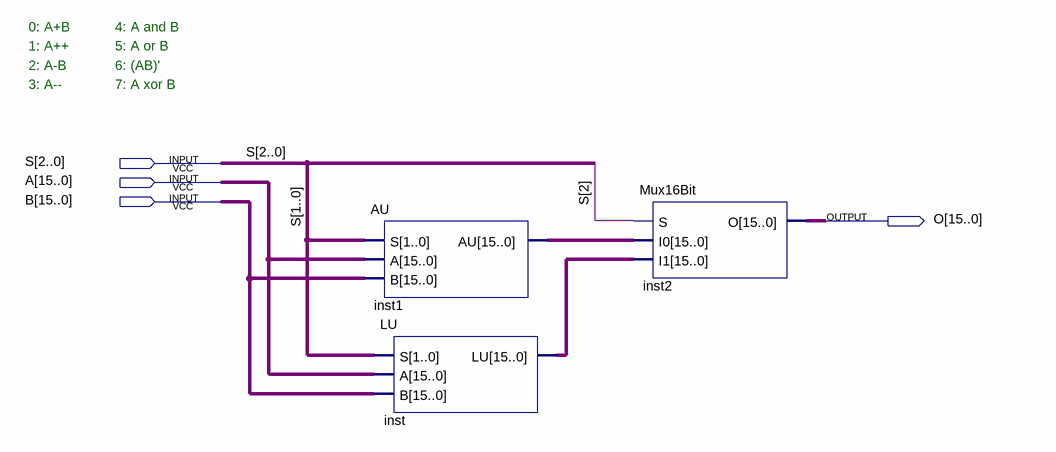
[diagram p0: schematic sheet]
// Quartus schematic ALU.bdf as structural Verilog: 3 symbols, 4 pins
module ALU (
  input  [2:0] S,
  input  [15:0] A,
  input  [15:0] B,
  output [15:0] O
);

  wire [15:0] inst1_au, inst_lu;

  AU inst1 (.S(S[1:0]), .A(A), .B(B), .AU(inst1_au));
  LU inst (.S(S[1:0]), .A(A), .B(B), .LU(inst_lu));
  Mux16Bit inst2 (.S(S[2]), .I0(inst1_au), .I1(inst_lu), .O(O));

  // Notes on the sheet:
  //   0: A+B
  //   4: A and B
  //   1: A++
  //   5: A or B
  //   2: A-B
  //   6: (AB)'
  //   3: A--
  //   7: A xor B
endmodule
